# Altium schematic sheet MAX30100_Sensor.SchDoc
size A4; SheetNumber: 1; SheetTotal: 1
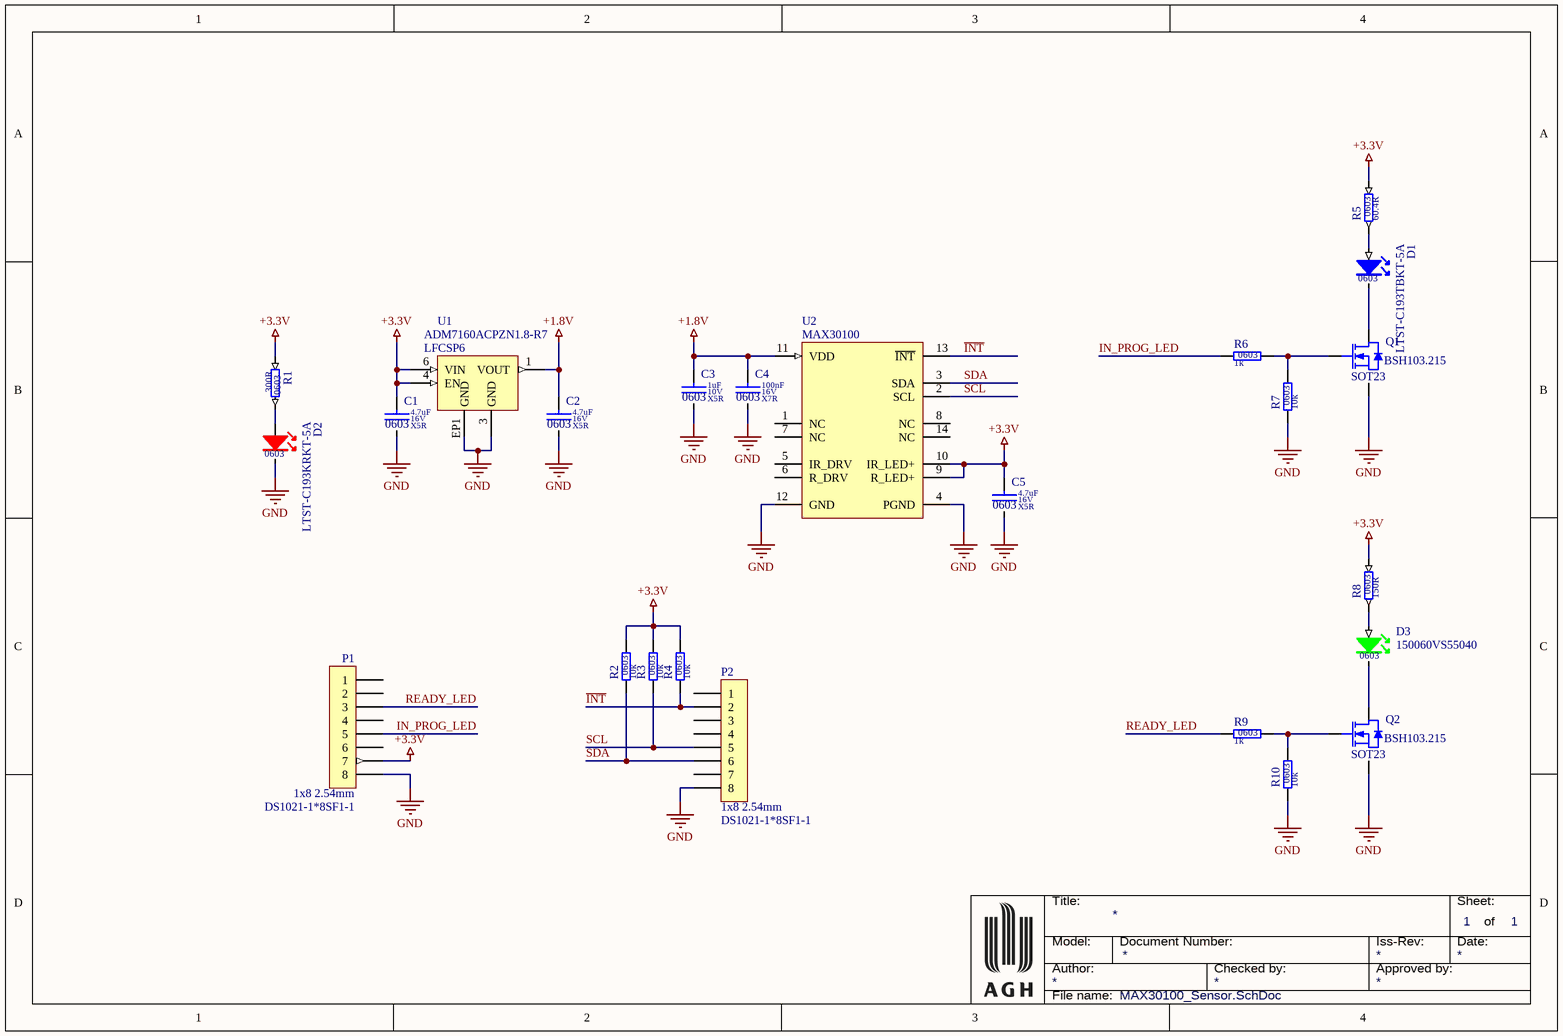
[diagram p0: MAX30100_Sensor.SchDoc]

## Parts
C1  value 4.7uF  Dielectric: X5R  Voltage: 16V  SCH_Footprint: 0603  [C_0603_1608]  (hidden comment: Ceramic X5R)
C2  value 4.7uF  Dielectric: X5R  Voltage: 16V  SCH_Footprint: 0603  [C_0603_1608]  (hidden comment: Ceramic X5R)
C3  value 1uF  Dielectric: X5R  Voltage: 10V  SCH_Footprint: 0603  [C_0603_1608]  (hidden comment: Ceramic X5R)
C4  value 100nF  Dielectric: X7R  Voltage: 16V  SCH_Footprint: 0603  [C_0603_1608]  (hidden comment: Ceramic X7R)
C5  value 4.7uF  Dielectric: X5R  Voltage: 16V  SCH_Footprint: 0603  [C_0603_1608]  (hidden comment: Ceramic X5R)
D1  value LTST-C193TBKT-5A  SCH_Footprint: 0603  [OL_0603_1608]  (hidden comment: Blue LED 0603)
D2  value LTST-C193KRKT-5A  SCH_Footprint: 0603  [OL_0603_1608]  (hidden comment: Red LED 0603)
D3  value 150060VS55040  SCH_Footprint: 0603  [OL_0603_1608]  (hidden comment: Green LED 0603)
P1  value DS1021-1*8SF1-1  SCH_Footprint: 1x8 2.54mm  [P_HEADER_1x8_2.54]  (hidden comment: Goldpin)
P2  value DS1021-1*8SF1-1  SCH_Footprint: 1x8 2.54mm  [P_HEADER_1x8_2.54]  (hidden comment: Goldpin)
Q1  value BSH103.215  SCH_Footprint: SOT23  [SOT23_TO236_SC59]  (hidden comment: BSH103)
Q2  value BSH103.215  SCH_Footprint: SOT23  [SOT23_TO236_SC59]  (hidden comment: BSH103)
R1  value 300R  SCH_Footprint: 0603  [R_0603_1608]  (hidden comment: Resistor)
R2  value 10k  SCH_Footprint: 0603  [R_0603_1608]  (hidden comment: Resistor)
R3  value 10k  SCH_Footprint: 0603  [R_0603_1608]  (hidden comment: Resistor)
R4  value 10k  SCH_Footprint: 0603  [R_0603_1608]  (hidden comment: Resistor)
R5  value 60.4R  SCH_Footprint: 0603  [R_0603_1608]  (hidden comment: Resistor)
R6  value 1k  SCH_Footprint: 0603  [R_0603_1608]  (hidden comment: Resistor)
R7  value 10k  SCH_Footprint: 0603  [R_0603_1608]  (hidden comment: Resistor)
R8  value 150R  SCH_Footprint: 0603  [R_0603_1608]  (hidden comment: Resistor)
R9  value 1k  SCH_Footprint: 0603  [R_0603_1608]  (hidden comment: Resistor)
R10  value 10k  SCH_Footprint: 0603  [R_0603_1608]  (hidden comment: Resistor)
U1  value ADM7160ACPZN1.8-R7  SCH_Footprint: LFCSP6  [LFCSP-6-3]  (hidden comment: ADM7160ACPZN1.8-R2)
U2  MAX30100  [MAX30100]

## Nets
+1.8V: C2.1 C3.1 C4.1 U1.1(VOUT) U2.11(VDD)
+3.3V: C1.1 C5.1 P1.7 R1.1 R2.2 R3.2 R4.2 R5.2 R8.2 U1.4(EN) U1.6(VIN) U2.9(R_LED+) U2.10(IR_LED+)
GND: C1.2 C2.2 C3.2 C4.2 C5.2 D2.1(K) P1.8 P2.8 Q1.2(S) Q2.2(S) R7.1 R10.1 U1.3(GND) U1.EP1(GND) U2.4(PGND) U2.12(GND)
~{INT}: P2.2 R4.1 U2.13(~{INT})
IN_PROG_LED: P1.5 R6.1
READY_LED: P1.3 R9.1
SCL: P2.5 R3.1 U2.2(SCL)
SDA: P2.6 R2.1 U2.3(SDA)
NetD1_1: D1.1(K) Q1.3(D)
NetD1_2: D1.2(A) R5.1
NetD2_2: D2.2(A) R1.2
NetD3_1: D3.1(K) Q2.3(D)
NetD3_2: D3.2(A) R8.1
NetQ1_1: Q1.1(G) R6.2 R7.2
NetQ2_1: Q2.1(G) R9.2 R10.2

Not connected (* = marked no-connect by the designer): P1 1 2 4 6; P2 1 3 4 7; U1 2(NC) 5(NC); U2 1(NC) 5(IR_DRV) 6(R_DRV) 7(NC) 8(NC) 14(NC)

## Notes on the sheet
- Title:
- Sheet:
- of
- Author:
- Model:
- Document Number:
- Checked by:
- Iss-Rev:
- Approved by:
- Date:
- File name:

## Library data of the parts
C1 C2 C5 = C_4.7uF_16V_X5R_0603_10: Capacitor; Manufacturer: Murata; Manufacturer Part Number: GRM188R61C475KAAJD; Tolerance (%): 10; Part Number: C_4.7uF_16V_X5R_0603_10; HelpURL: https://datasheet.octopart.com/GRM188R61C475KAAJD-Murata-datasheet-66077093.pdf; Supplier 1: TME; Supplier 2: RS Components; Supplier Part Number 2: 884-7264P; Supplier 3: Farnell; Supplier Part Number 3: 2611924; Supplier 4: Mouser; Supplier Part Number 4: 81-GRM188R61C475KAJD; Supplier 5: Digi-Key; Supplier Part Number 5: 490-10481-2-ND; Supplier 6: LCSC
C3 = C_1uF_10V_X5R_0603_10: Capacitor; Manufacturer: Murata; Manufacturer Part Number: GRM188R61A105KA61J; Tolerance (%): 10; Part Number: C_1uF_10V_X5R_0603_10; HelpURL: https://datasheet.octopart.com/GRM188R61A105KA61J-Murata-datasheet-66077091.pdf; Supplier 1: TME; Supplier 2: RS Components; Supplier 3: Farnell; Supplier 4: Mouser; Supplier Part Number 4: 81-GRM18R61A105KA61J; Supplier 5: Digi-Key; Supplier Part Number 5: 490-6408-1-ND; Supplier 6: LCSC
C4 = C_100nF_16V_X7R_0603_10: Capacitor; Manufacturer: Kemet; Manufacturer Part Number: C0603C104K4RAC7013; Tolerance (%): 10; Part Number: C_100nF_16V_X7R_0603_10; HelpURL: https://pl.mouser.com/datasheet/2/212/KEM_C1002_X7R_SMD-1102033.pdf; Supplier 1: TME; Supplier 2: RS Components; Supplier 3: Farnell; Supplier 4: Mouser; Supplier Part Number 4: 80-C0603C104K4RC7013; Supplier 5: Digi-Key; Supplier Part Number 5: 399-7372-2-ND; Supplier 6: LCSC
D1 = OL_B_0603_LTST-C193TBKT-5A: LED_BLUE; Manufacturer: Lite-On; Part Number: OL_B_0603_LTST-C193TBKT-5A; HelpURL: https://pl.mouser.com/datasheet/2/239/Lite-On-LTST-C193TBKT-5A-1175300.pdf; Manufacturer Part Number: LTST-C193TBKT-5A; Supplier 1: TME; Supplier Part Number 1: LTST-C193TBKT-5A; Supplier 2: RS Components; Supplier Part Number 2: 6921051; Supplier 3: Farnell; Supplier 4: Mouser; Supplier Part Number 4: 859-LTSTC193TBKT5A; Supplier 5: Digi-Key; Supplier Part Number 5: 160-1827-1-ND; Supplier 6: LCSC
D2 = OL_R_0603_LTST-C193KRKT-5A: LED_RED; Manufacturer: Lite-On; Part Number: OL_R_0603_LTST-C193KRKT-5A; HelpURL: https://pl.mouser.com/datasheet/2/239/LTST-C193KRKT-5A-1141706.pdf; Manufacturer Part Number: LTST-C193KRKT-5A; Supplier 1: TME; Supplier Part Number 1: LTST-C193KRKT-5A; Supplier 2: RS Components; Supplier Part Number 2: 6921041; Supplier 3: Farnell; Supplier 4: Mouser; Supplier Part Number 4: 859-LTSTC193KRKT5A; Supplier 5: Digi-Key; Supplier Part Number 5: 160-1830-1-ND; Supplier 6: LCSC
D3 = OL_G_0603_150060VS55040: LED GREEN; Manufacturer: Wurth; Part Number: OL_G_0603_150060VS55040; HelpURL: https://datasheet.octopart.com/150060VS55040-W%C3%BCrth-Elektronik-datasheet-140170128.pdf; Manufacturer Part Number: 150060VS55040; Supplier 1: TME; Supplier Part Number 1: OSG80603C1E; Supplier 2: RS Components; Supplier Part Number 2: 1766157; Supplier 3: Farnell; Supplier Part Number 3: 2900765; Supplier 4: Mouser; Supplier Part Number 4: 710-150060VS55040; Supplier 5: Digi-Key; Supplier Part Number 5: 732-12017-1-ND; Supplier 6: LCSC
P1 P2 = P_HEADER_1x8_2.54: Pin Header; Manufacturer: Connfly; Part Number: P_HEADER_1x8_2.54; HelpURL: http://www.tme.eu/en/Document/cc301e58a5da78cb543a94b5a5b7f06a/DS1021.pdf; Manufacturer Part Number: DS1021-1*8SF1-1; Supplier 1: TME; Supplier Part Number 1: ZL201-08G; Supplier 2: RS Components; Supplier 3: Farnell; Supplier 4: Mouser; Supplier 5: Digi-Key; Supplier 6: LCSC
Q1 Q2 = QN_BSH103: Manufacturer: Nexperia; Type: N-MOS; Voltage: 30V; Current: 0A85; Part Number: QN_BSH103; HelpURL: http://datasheet.octopart.com/BSH103.215-Philips-datasheet-125753.pdf; Manufacturer Part Number: BSH103.215; Supplier 1: TME; Supplier Part Number 1: BSH103.215; Supplier 2: RS Components; Supplier 3: Farnell; Supplier Part Number 3: 2336818; Supplier 4: Mouser; Supplier Part Number 4: 771-BSH103-T/R; Supplier 5: Digi-Key; Supplier Part Number 5: 1727-4319-1-ND; Supplier 6: LCSC
R1 = R_300R_0603_1: Manufacturer: Yageo; Manufacturer Part Number: RC0603FR-07300RL; Voltage: 50V; Power: 100mW; Tolerance: 1%; Part Number: R_300R_0603_1; HelpURL: https://www.tme.eu/Document/d2a72e545e5c8eb7bf2a04fa97535928/rc0603yageo.pdf; Supplier 1: TME; Supplier Part Number 1: RC0603FR-07300R; Supplier 2: RS Components; Supplier 3: Farnell; Supplier Part Number 3: 2413696; Supplier 4: Mouser; Supplier Part Number 4: 603-RC0603FR-07300RL; Supplier 5: Digi-Key; Supplier Part Number 5: 311-300HRCT-ND; Supplier 6: LCSC
R2-R4 R7 R10 = R_10k_0603_1: Manufacturer: Vishay; Manufacturer Part Number: CRCW060310K0FKTABC; Voltage: 75V; Power: 100mW; Tolerance: 1%; Part Number: R_10k_0603_1; HelpURL: http://www.tme.eu/pl/Document/622e28308c06d160637f2b14751ba16b/Data%20Sheet%20CRCW_BCe3.pdf; Supplier 1: TME; Supplier Part Number 1: CRCW060310K0FKTABC; Supplier 2: RS Components; Supplier 3: Farnell; Supplier 4: Mouser; Supplier Part Number 4: 667-ERJ-3EKF1002V; Supplier 5: Digi-Key; Supplier Part Number 5: P10KGCT-ND; Supplier 6: LCSC
R5 = R_60.4R_0603_1: Manufacturer: Vishay; Manufacturer Part Number: CRCW060360R4FKEA; Voltage: 75V; Power: 100mW; Tolerance: 1%; Part Number: R_60.4R_0603_1; HelpURL: https://datasheet.octopart.com/CRCW060360R4FKEA-Vishay-datasheet-41302739.pdf; Supplier 1: TME; Supplier 2: RS Components; Supplier Part Number 2: 6790598; Supplier 3: Farnell; Supplier Part Number 3: 2141252; Supplier 4: Mouser; Supplier Part Number 4: 71-CRCW0603-60.4-E3; Supplier 5: Digi-Key; Supplier Part Number 5: 541-60.4HCT-ND; Supplier 6: LCSC
R6 R9 = R_1k_0603_1: Manufacturer: Vishay; Manufacturer Part Number: CRCW06031K00FKEA; Voltage: 75V; Power: 100mW; Tolerance: 1%; Part Number: R_1k_0603_1; HelpURL: http://www.farnell.com/datasheets/2310790.pdf?_ga=2.256888843.1690599162.1548417389-1379097396.1542296996&_gac=1.262631934.1547230258.Cj0KCQiAmuHhBRD0ARIsAFWyPwhX8HcvXnM3tA0ZBodZLzDIjH2ZxLpjT5LWo9bad_HPRbU8LfPq44UaAhEwEALw_wcB; Supplier 1: TME; Supplier 2: RS Components; Supplier Part Number 2: 678-9875P; Supplier 3: Farnell; Supplier Part Number 3: 1469740; Supplier 4: Mouser; Supplier Part Number 4: 71-CRCW0603-1.0K-E3; Supplier 5: Digi-Key; Supplier Part Number 5: 541-1.00KHCT-ND; Supplier 6: LCSC
R8 = R_150R_0603_1: Manufacturer: Royalohm; Manufacturer Part Number: 0603SAF1500T5E; Voltage: 50V; Power: 100mW; Tolerance: 1%; Part Number: R_150R_0603_1; HelpURL: http://www.tme.eu/pl/Document/b315665a56acbc42df513c99b390ad98/ROYALOHM-THICKFILM.pdf; Supplier 1: TME; Supplier Part Number 1: SMD0603-150R-1%; Supplier 2: RS Components; Supplier 3: Farnell; Supplier 4: Mouser; Supplier 5: Digi-Key; Supplier 6: LCSC
U1 = VL_ADM7160ACPZN1.8-R7: Manufacturer: Analog Devices; Voltage: 1.8V; Current: 200mA; Part Number: VL_ADM7160ACPZN1.8-R7; HelpURL: http://datasheet.octopart.com/ADM7160ACPZN1.8-R2-Analog-Devices-datasheet-26822004.pdf; Manufacturer Part Number: ADM7160ACPZN1.8-R7; Supplier 1: TME; Supplier 2: RS Components; Supplier 3: Farnell; Supplier 4: Mouser; Supplier Part Number 4: 584-DM7160ACPZN1.8R7; Supplier 5: Digi-Key; Supplier Part Number 5: ADM7160ACPZN1.8-R7CT-ND; Supplier 6: LCSC
U2 = U_MAX30100: Frequency (kHz): 0; SCH_Footprint: MAX30100; Part Number: U_MAX30100; Vin min (V): 0; Vin max (V): 0; Vout min (V): 0; Vout max (V): 0; Imax (A): 0; Iswitch (A): 0; HelpURL: https://datasheets.maximintegrated.com/en/ds/MAX30100.pdf; Supplier 1: TME; Supplier 2: RS Components; Supplier 3: Farnell; Supplier 4: Mouser; Supplier 5: Digi-Key; Supplier 6: LCSC